# Altium schematic sheet rtc.SchDoc: Test
size A4; DrawnBy: Łukasz Przeniosło; Organization: Zachodniopomorski; Address1: Uniwersytet Technologiczny; Address2: w Szczecinie; Address3: Wydział Elektryczny; DocumentNumber: 5; Revision: 1.0; SheetNumber: 5; SheetTotal: 8
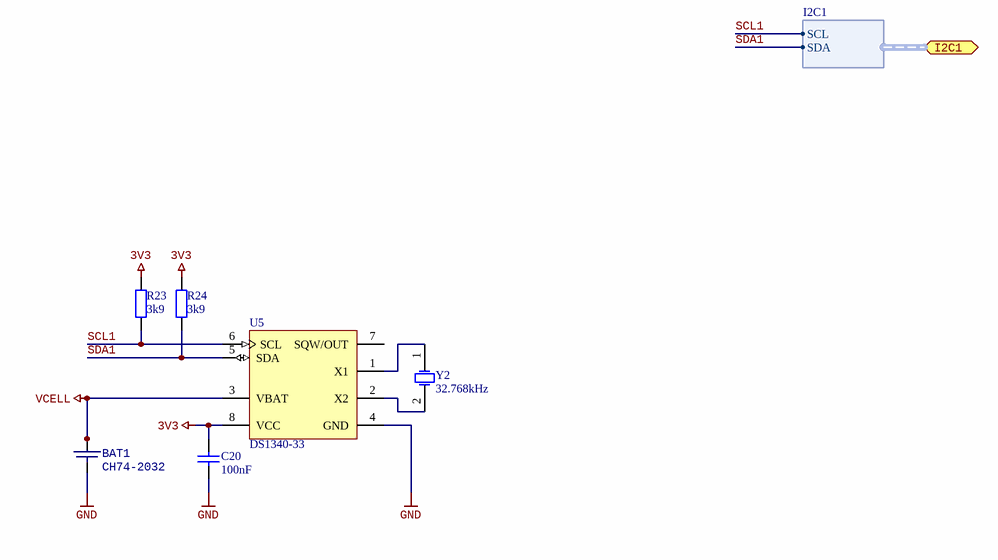
[diagram p0: rtc.SchDoc]

## Parts
BAT1  CH74-2032  [BAT_2032_HOLDER]
C20  100nF  [CAPC1608N]
R23  3k9  [RESC1608N]
R24  3k9  [RESC1608N]
U5  DS1340-33  [SO-8_L]
Y2  32.768kHz  [ABS25-crystal]

## Ports
I2C1 (harness I2C1)

## Harnesses
I2C1: SCL, SDA

## Nets
3V3: C20.2 R23.1 R24.1 U5.8(VCC)
GND: BAT1.3(BAT-) C20.1 U5.4(GND)
VCELL: BAT1.1(BAT+) BAT1.2(BAT+) U5.3(VBAT)
SCL1: R23.2 U5.6(SCL) ; port I2C1.SCL
SDA1: R24.2 U5.5(SDA) ; port I2C1.SDA
NetU5_1: U5.1(X1) Y2.1(OSC1)
NetU5_2: U5.2(X2) Y2.2(OSC2)

Not connected (* = marked no-connect by the designer): U5 7(SQW/OUT)

## Notes on the sheet
- Title
- Size:
- Date:
- A4
- Author:
- Time:
- Sheet
- of
- File:

## Library data of the parts
C20 = Capacitor: Value: 100nF
R23 R24 = Resistor: Tolerance: 5%; Power: 0W; Value: 3k9
U5 = CMP-0254-00324-1: 64 x 8, Serial, I2C Real-Time Clock, 5.0V, 8-Pin SO, -40 to 85 degC, Pb-Free; PackageDescription: 8-Pin Small-Outline IC, Narrow (0.15in), 1.27 mm Pitch, SOIC (N), Pb-Free; PackageVersion: revC, 2010; ComponentLink3URL: http://pdfserv.maxim-ic.com/package_dwgs/21-0041.PDF; Code_IPC: SOIC127P600-8; Code_JEDEC: MS-012-AA; ComponentLink2Description: Datasheet; ComponentLink3Description: Package Specification; PackageReference: S8+2; DatasheetVersion: 10-Feb-2008; ComponentLink2URL: http://datasheets.maxim-ic.com/en/ds/DS1307.pdf; ComponentLink1Description: Manufacturer URL; ComponentLink1URL: http://www.maxim-ic.com
Y2 = XTAL: Crystal Oscillator; Value: 32.768kHz